# EasyEDA Pro project ProPrj_Micro-Profilometer_2025-09-25.epro, schematic Sch

## Sheets
1 Power: Board Name: 3DOF_DriveBoard; Create Date: 2025-06-26; Page Name: Power; Project Name: 3DOFPlatform; Schematic Name: 3DOF_DriveBoard; Update Date: 2025-07-22; Add into BOM: yes; Convert to PCB: yes
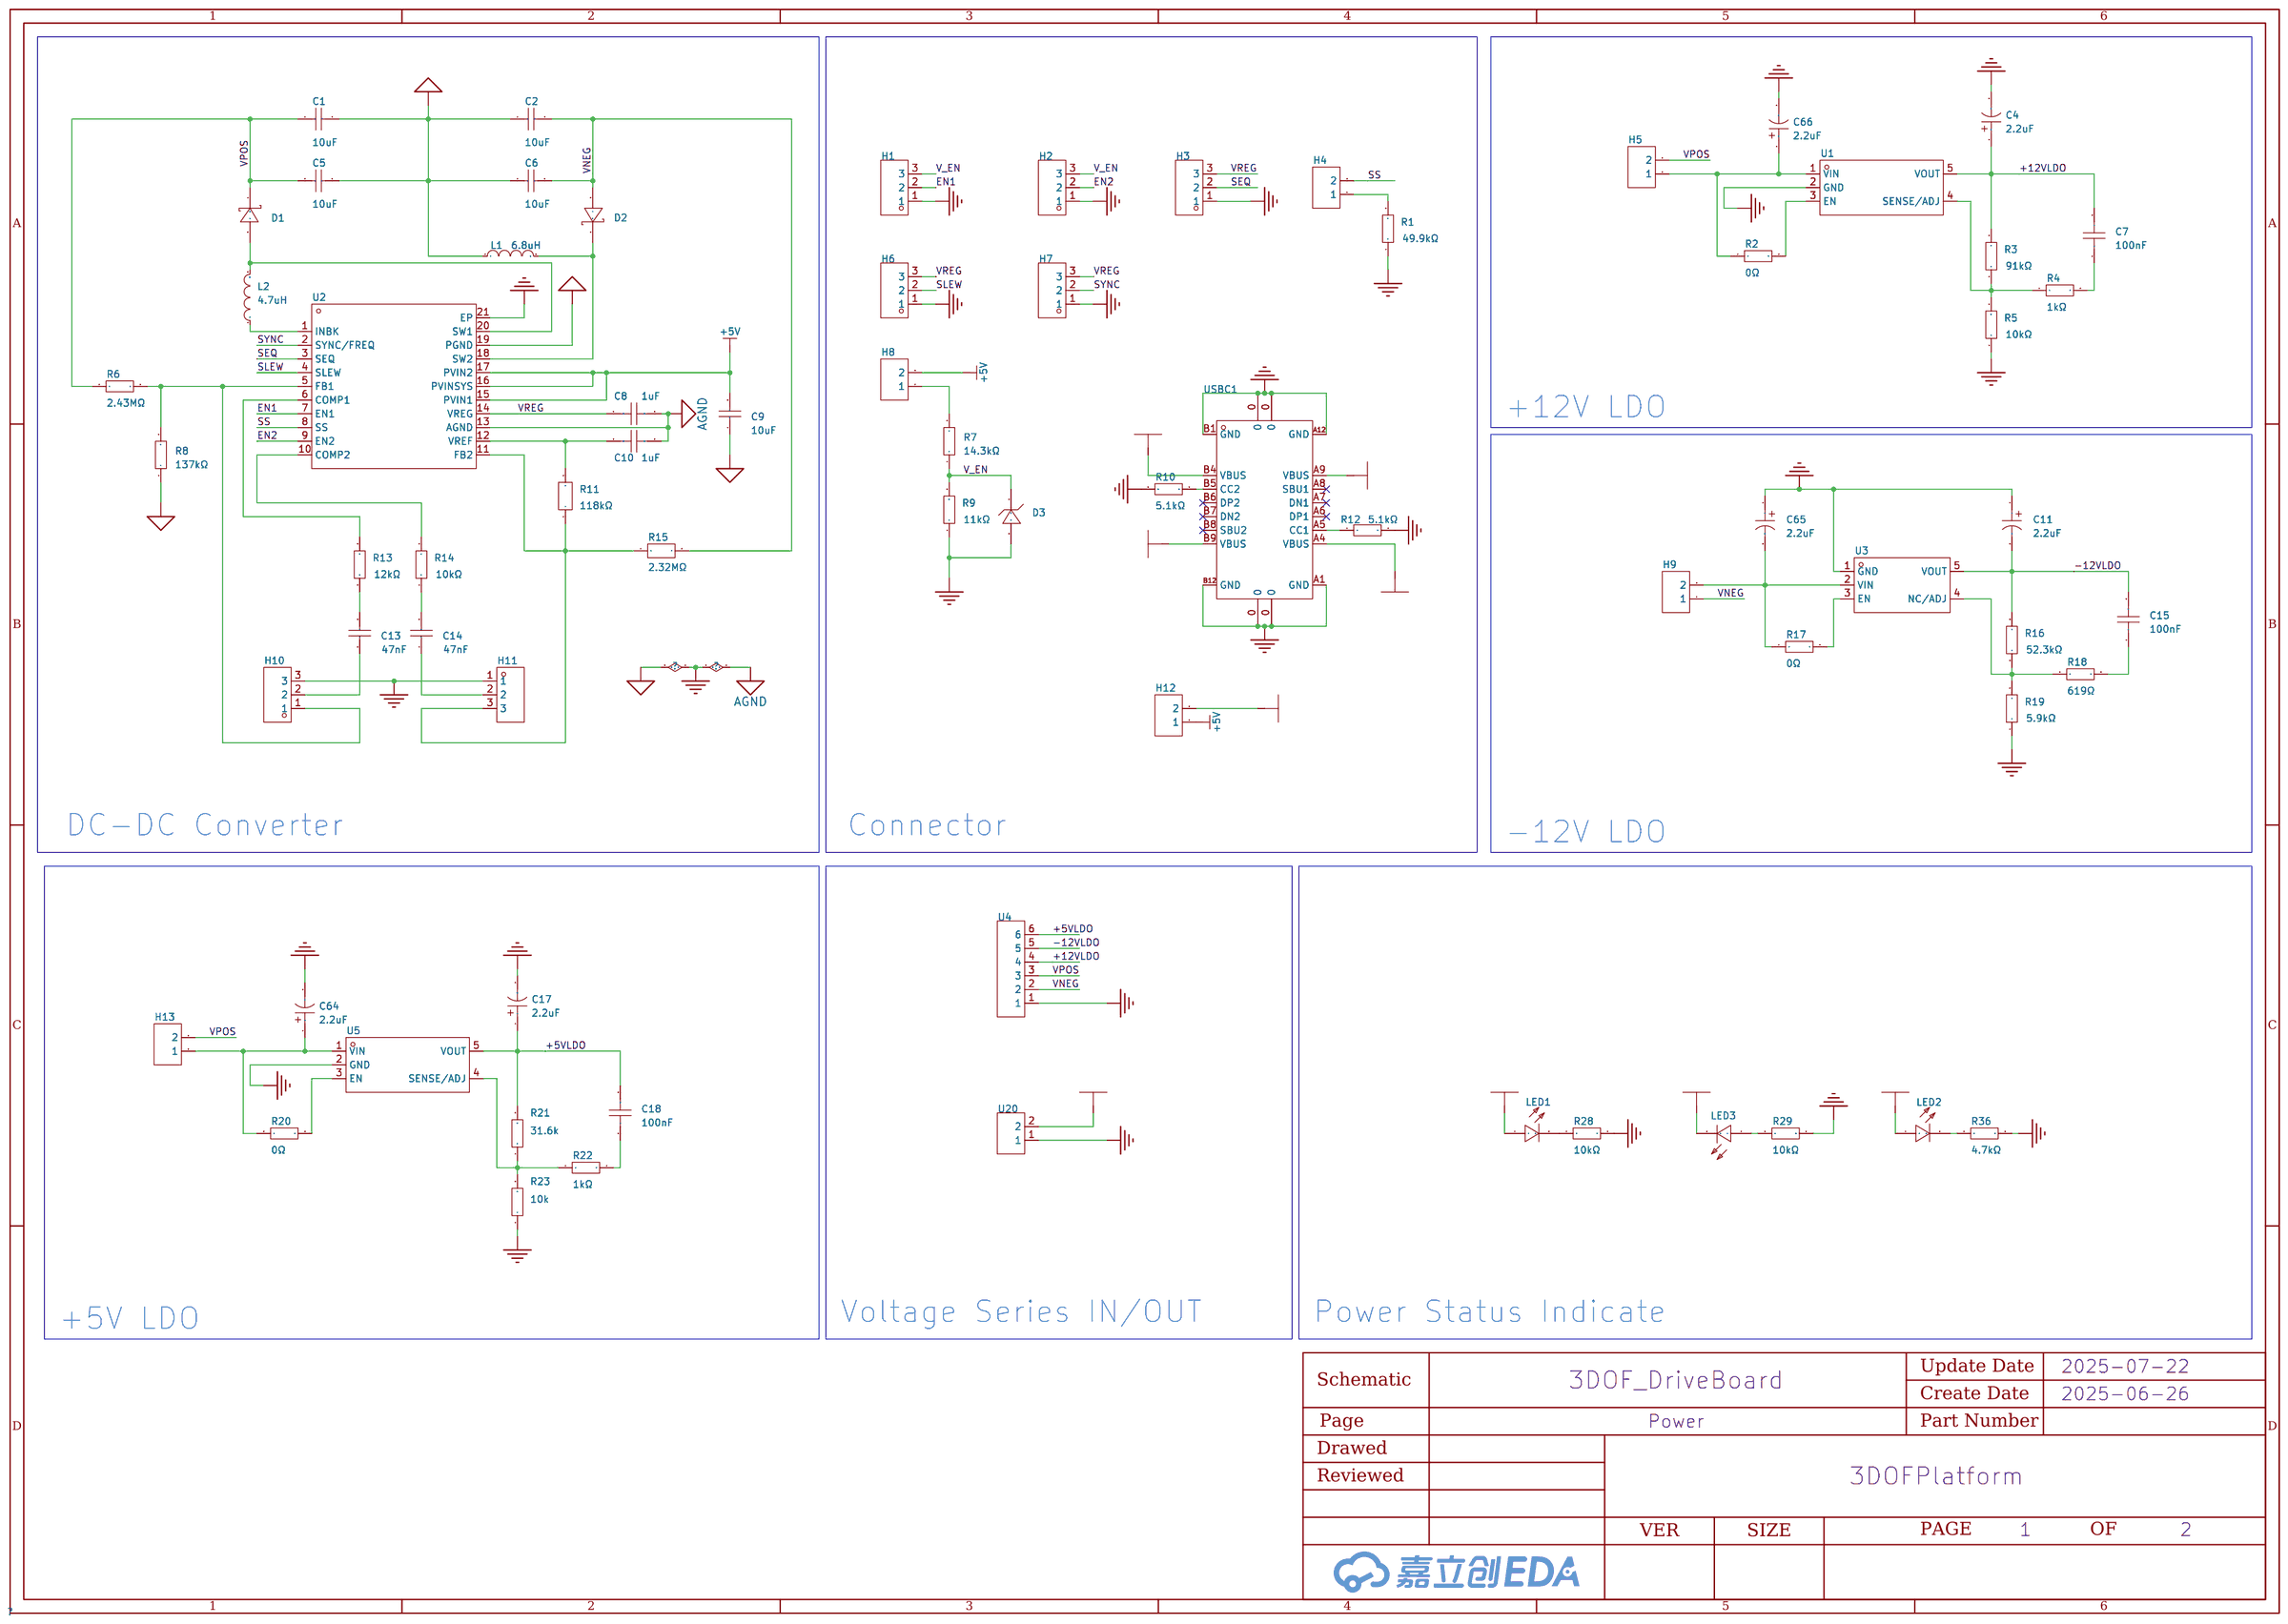
[diagram p0: Power]
2 Drivers: Board Name: MicroProfilometer; Create Date: 2025-09-18; Page Name: Drivers; Project Name: 微米级轮廓仪Micro-Profilometer; Schematic Name: Sch; Update Date: 2025-09-18; Company: 嘉立创EDA; Page Size: A3; Version: V1.0
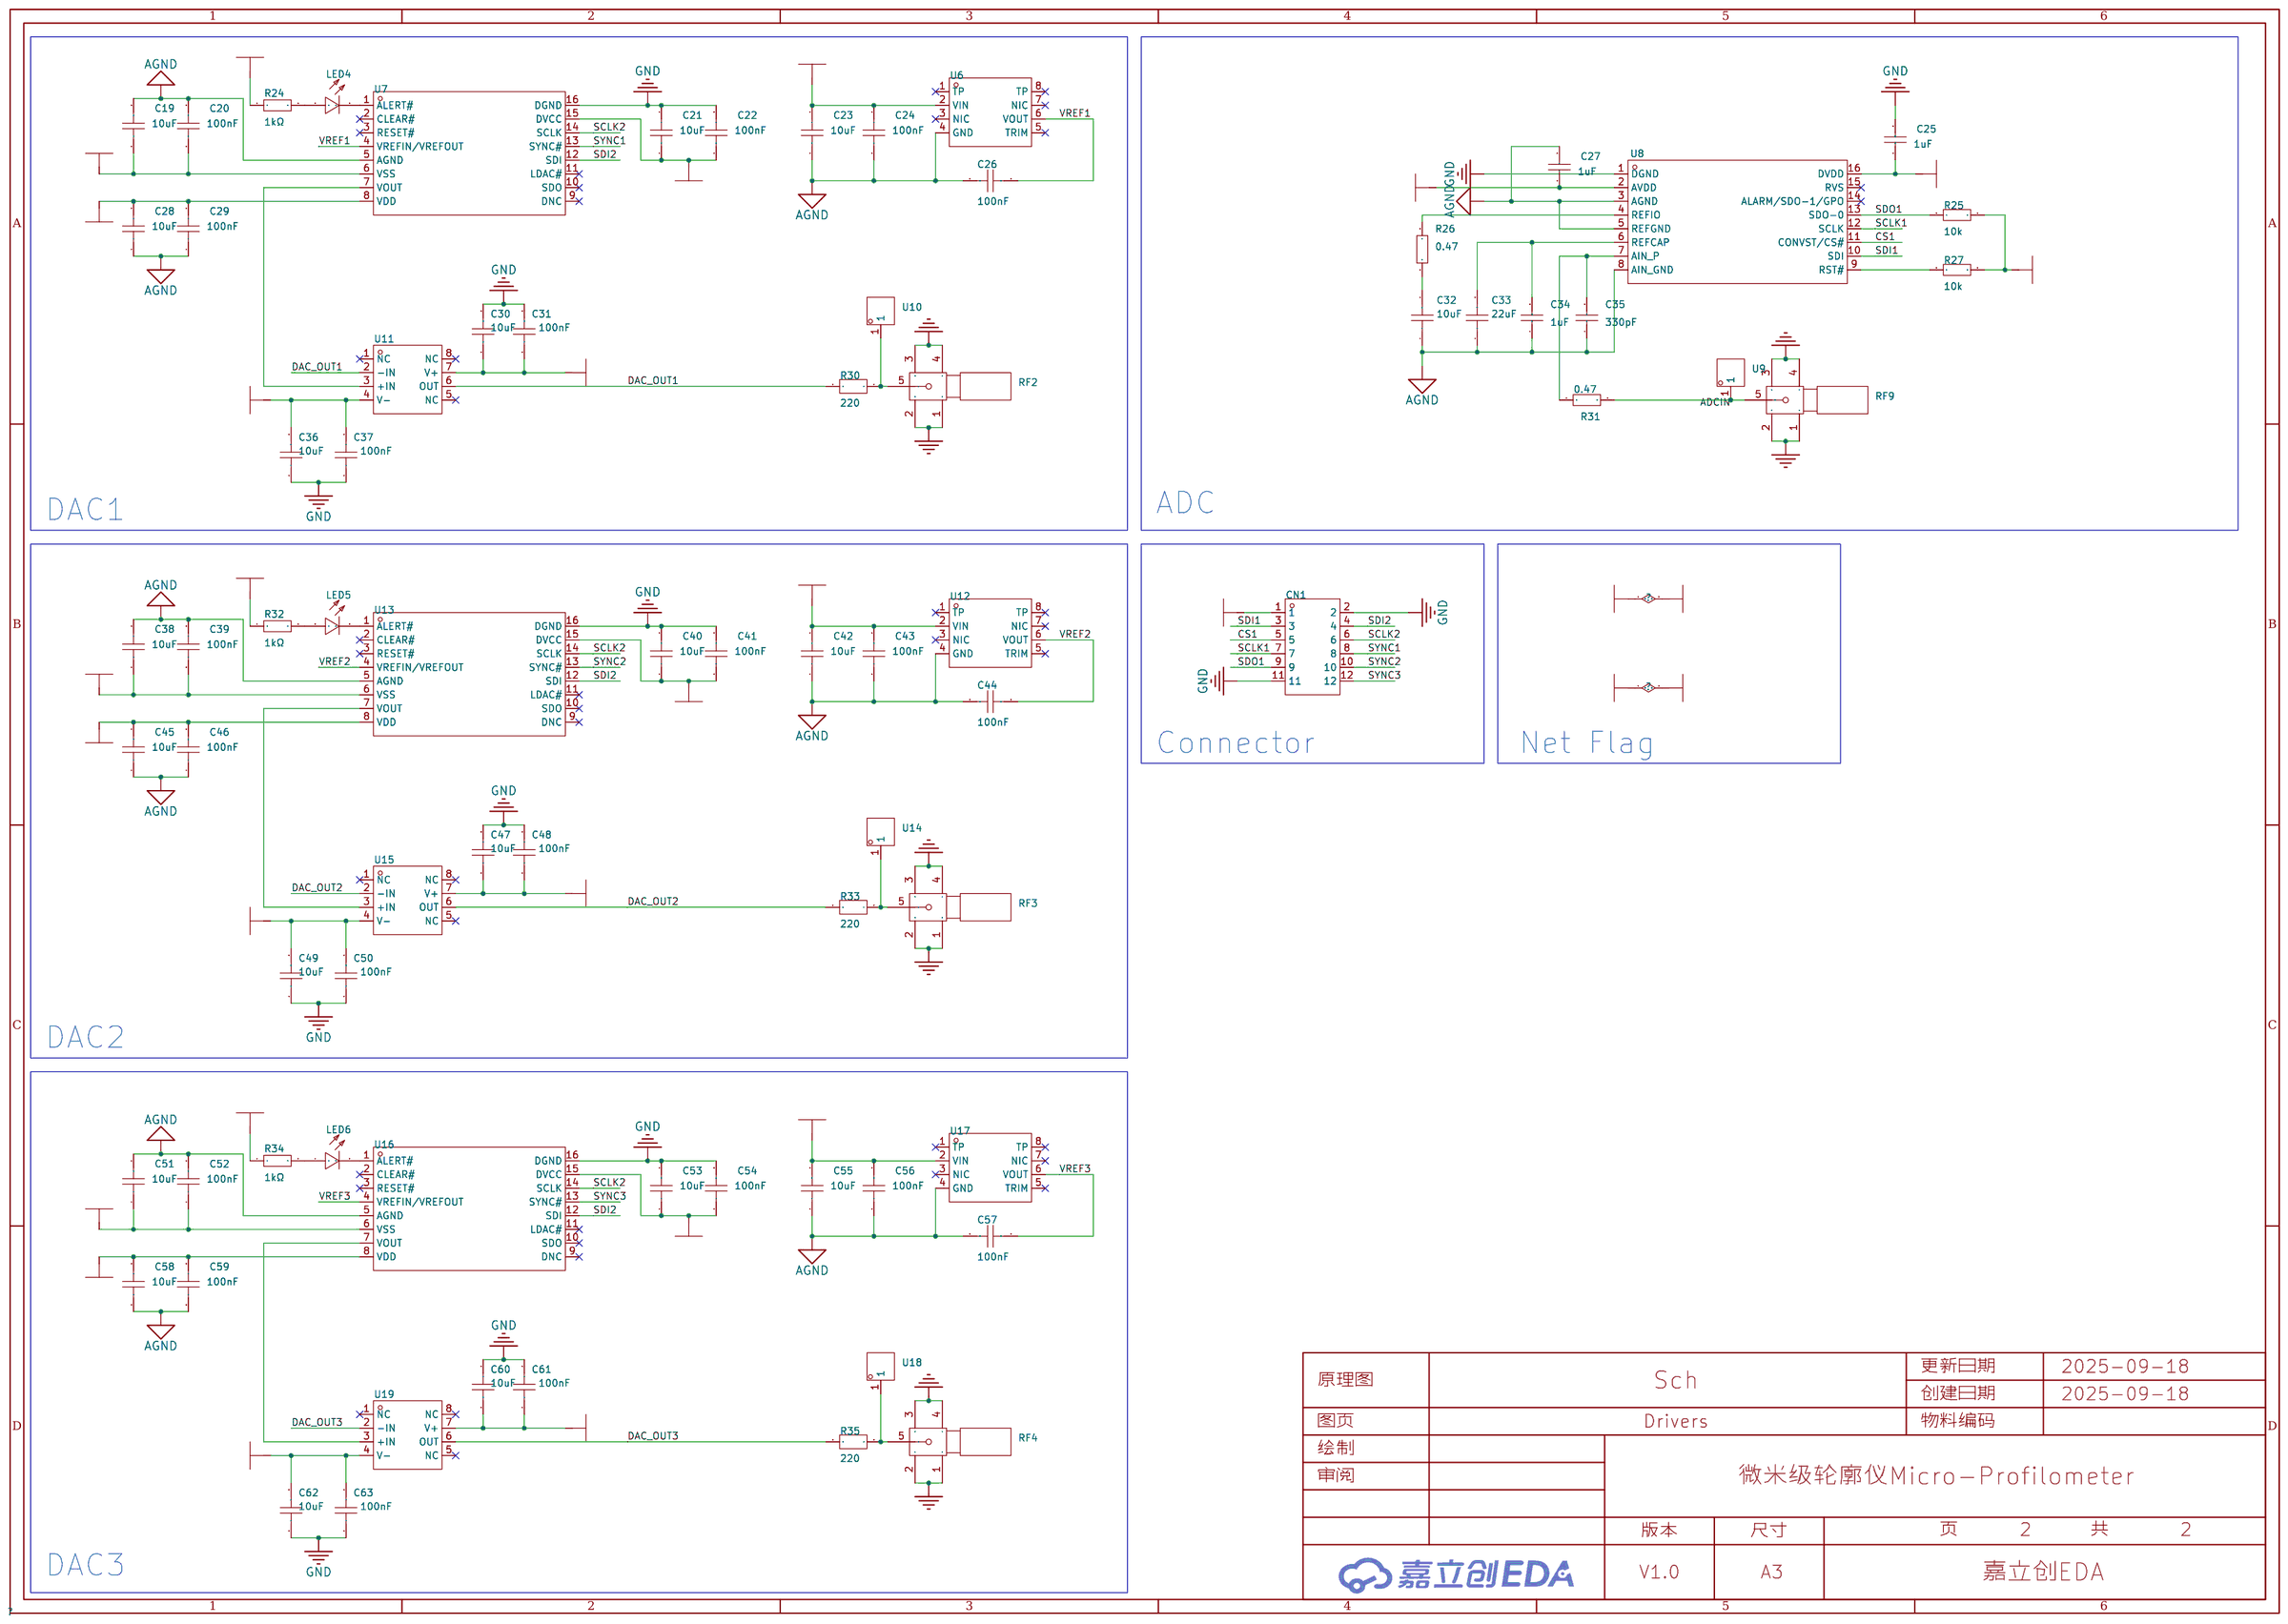
[diagram p1: Drivers]

## Parts
sheet Drivers
C19  10uF  [C0603]
C20  100nF  [C0603]
C21  10uF  [C0603]
C22  100nF  [C0603]
C23  10uF  [C0603]
C24  100nF  [C0603]
C25  1uF  [C0603]
C26  100nF  [C0603]
C27  1uF  [C0603]
C28  10uF  [C0603]
C29  100nF  [C0603]
C30  10uF  [C0603]
C31  100nF  [C0603]
C32  10uF  [C0603]
C33  22uF  [C0603]
C34  1uF  [C0603]
C35  330pF  [C0603]
C36  10uF  [C0603]
C37  100nF  [C0603]
C38  10uF  [C0603]
C39  100nF  [C0603]
C40  10uF  [C0603]
C41  100nF  [C0603]
C42  10uF  [C0603]
C43  100nF  [C0603]
C44  100nF  [C0603]
C45  10uF  [C0603]
C46  100nF  [C0603]
C47  10uF  [C0603]
C48  100nF  [C0603]
C49  10uF  [C0603]
C50  100nF  [C0603]
C51  10uF  [C0603]
C52  100nF  [C0603]
C53  10uF  [C0603]
C54  100nF  [C0603]
C55  10uF  [C0603]
C56  100nF  [C0603]
C57  100nF  [C0603]
C58  10uF  [C0603]
C59  100nF  [C0603]
C60  10uF  [C0603]
C61  100nF  [C0603]
C62  10uF  [C0603]
C63  100nF  [C0603]
CN1  X9555WR-2x06-6TV01  [IDC-TH_12P-P2.54_BOOMELE-2X6P]
LED4  -  [LED0603-R-RD]
LED5  -  [LED0603-R-RD]
LED6  -  [LED0603-R-RD]
R24  1kΩ  [R0603]
R25  10k  [R0603]
R26  0.47  [R0603]
R27  10k  [R0603]
R30  220  [R0603]
R31  0.47  [R0603]
R32  1kΩ  [R0603]
R33  220  [R0603]
R34  1kΩ  [R0603]
R35  220  [R0603]
RF2  -  [SMA-TH_BWSMA-KWE-Z001]
RF3  -  [SMA-TH_BWSMA-KWE-Z001]
RF4  -  [SMA-TH_BWSMA-KWE-Z001]
RF9  -  [SMA-TH_BWSMA-KWE-Z001]
U6  -  [SOIC-8_L4.9-W3.9-P1.27-LS6.0-BL]
U7  -  [TSSOP-16_L5.0-W4.4-P0.65-LS6.4-TL]
U8  -  [TSSOP-16_L5.0-W4.4-P0.65-LS6.4-TL]
U9  -  [TEST-SMD_L2.7-W1.0]
U10  -  [TEST-SMD_L2.7-W1.0]
U11  -  [SOIC-8_L4.9-W3.9-P1.27-LS6.0-BL]
U12  -  [SOIC-8_L4.9-W3.9-P1.27-LS6.0-BL]
U13  -  [TSSOP-16_L5.0-W4.4-P0.65-LS6.4-TL]
U14  -  [TEST-SMD_L2.7-W1.0]
U15  -  [SOIC-8_L4.9-W3.9-P1.27-LS6.0-BL]
U16  -  [TSSOP-16_L5.0-W4.4-P0.65-LS6.4-TL]
U17  -  [SOIC-8_L4.9-W3.9-P1.27-LS6.0-BL]
U18  -  [TEST-SMD_L2.7-W1.0]
U19  -  [SOIC-8_L4.9-W3.9-P1.27-LS6.0-BL]
sheet Power
C1  10uF  [C1206]
C2  10uF  [C1206]
C4  2.2uF  [CAP-SMD_L3.2-W1.6]
C5  10uF  [C1206]
C6  10uF  [C1206]
C7  100nF  [C0603]
C8  1uF  [C0603]
C9  10uF  [C1206]
C10  1uF  [C0603]
C11  2.2uF  [CAP-SMD_L3.2-W1.6]
C13  47nF  [C0603]
C14  47nF  [C0603]
C15  100nF  [C0603]
C17  2.2uF  [CAP-SMD_L3.2-W1.6]
C18  100nF  [C0603]
C64  2.2uF  [CAP-SMD_L3.2-W1.6]
C65  2.2uF  [CAP-SMD_L3.2-W1.6]
C66  2.2uF  [CAP-SMD_L3.2-W1.6]
D1  DFLS240-7  [POWERDI-123_L2.8-W1.8-LS3.7-RD]
D2  DFLS240-7  [POWERDI-123_L2.8-W1.8-LS3.7-RD]
D3  MMSZ5233B-7-F  [SOD-123_L2.7-W1.6-LS3.7-RD]
H1  -  [HDR-TH_3P-P2.54-V-F]
H2  -  [HDR-TH_3P-P2.54-V-F]
H3  -  [HDR-TH_3P-P2.54-V-F]
H4  -  [HDR-TH_2P-P2.54-V-F]
H5  -  [HDR-TH_2P-P2.54-V-F]
H6  -  [HDR-TH_3P-P2.54-V-F]
H7  -  [HDR-TH_3P-P2.54-V-F]
H8  -  [HDR-TH_2P-P2.54-V-F]
H9  -  [HDR-TH_2P-P2.54-V-F]
H10  -  [HDR-TH_3P-P2.54-V-F]
H11  -  [HDR-TH_3P-P2.54-V-F]
H12  -  [HDR-TH_2P-P2.54-V-F]
H13  -  [HDR-TH_2P-P2.54-V-F]
L1  6.8uH  [IND-SMD_L7.0-W6.6]
L2  4.7uH  [IND-SMD_L5.4-W5.2]
LED1  -  [LED0603-R-RD]
LED2  -  [LED0603-R-RD]
LED3  -  [LED0603-R-RD]
R1  49.9kΩ  [R0603]
R2  0Ω  [R0603]
R3  91kΩ  [R0603]
R4  1kΩ  [R0603]
R5  10kΩ  [R0603]
R6  2.43MΩ  [R0603]
R7  14.3kΩ  [R0603]
R8  137kΩ  [R0603]
R9  11kΩ  [R0603]
R10  5.1kΩ  [R0603]
R11  118kΩ  [R0603]
R12  5.1kΩ  [R0603]
R13  12kΩ  [R0603]
R14  10kΩ  [R0603]
R15  2.32MΩ  [R0603]
R16  52.3kΩ  [R0603]
R17  0Ω  [R0603]
R18  619Ω  [R0603]
R19  5.9kΩ  [R0603]
R20  0Ω  [R0603]
R21  31.6k  [R0603]
R22  1kΩ  [R0603]
R23  10k  [R0603]
R28  10kΩ  [R0603]
R29  10kΩ  [R0603]
R36  4.7kΩ  [R0603]
U1  ADP7118AUJZ-R7  [TSOT-23-5_L2.9-W1.6-P0.95-LS2.8-BR]
U2  ADP5070ACPZ-R7  [LFCSP-20_L4.0-W4.0-P0.50-TL-EP2.6]
U3  ADP7182AUJZ-R7  [TSOT-23-5_L2.9-W1.6-P0.95-LS2.8-BR]
U4  MX128-2.54-06P-GN01-Cu-Y-A  [CONN-TH_6P-P2.54_MX128-2.54-6P]
U5  ADP7118AUJZ-R7  [TSOT-23-5_L2.9-W1.6-P0.95-LS2.8-BR]
U20  DB125-2.54-2P-GN-S  [CONN-TH_DB125-2.54-2P-GN]
USBC1  -  [USB-C_SMD-TYPE-C-31-M-12]

## Library data of the parts
C19 C21 C23 C28 C30 C32 C36 C38 C40 C42 C45 C47 C49 C51 C53 C55 C58 C60 C62 = GRM188R61E106MA73D: 容值:10uF;精度:±20%;额定电压:25V;温度系数:X5R;; LCSC Part Name: 10uF ±20% 25V; Supplier Part: C91606; Manufacturer: muRata(村田); Supplier Footprint: 0603; JLCPCB Part Class: Extended Part; Datasheet: https://atta.szlcsc.com/upload/public/pdf/source/20161226/1482720176185.pdf; Supplier: LCSC; Tolerance: ±20%; Voltage Rated: 25V; Temperature Coefficient: X5R
C20 C22 C24 C26 C29 C31 C37 C39 C41 C43 C44 C46 C48 C50 C52 C54 C56 C57 C59 C61 C63 = CL10B104KA8NNNC: 容值:100nF;精度:±10%;额定电压:25V;温度系数:X7R;; LCSC Part Name: 100nF ±10% 25V; Supplier Part: C1590; Manufacturer: SAMSUNG(三星); Supplier Footprint: 0603; JLCPCB Part Class: Extended Part; Datasheet: https://atta.szlcsc.com/upload/public/pdf/source/20160103/1457707680294.pdf; Supplier: LCSC; Tolerance: ±10%; Voltage Rated: 25V; Temperature Coefficient: X7R
C25 C27 C34 = CL10A105KA8NNNC: 容值:1uF;精度:±10%;额定电压:25V;温度系数:X5R;; LCSC Part Name: 1uF ±10% 25V; Supplier Part: C5673; Manufacturer: SAMSUNG(三星); Supplier Footprint: 0603; JLCPCB Part Class: Extended Part; Datasheet: https://atta.szlcsc.com/upload/public/pdf/source/20160103/1457707739994.pdf; Supplier: LCSC; Tolerance: ±10%; Voltage Rated: 25V; Temperature Coefficient: X5R
C33 = CL10A226MP8NUNE: 容值:22uF;精度:±20%;额定电压:10V;温度系数:X5R;; LCSC Part Name: 22uF ±20% 10V; Supplier Part: C86295; Manufacturer: SAMSUNG(三星); Supplier Footprint: 0603; JLCPCB Part Class: Extended Part; Datasheet: https://atta.szlcsc.com/upload/public/pdf/source/20170325/1490427882169.pdf; Supplier: LCSC; Tolerance: ±20%; Voltage Rated: 10V; Temperature Coefficient: X5R
C35 = CL10C331JB8NNNC: 容值:330pF;精度:±5%;额定电压:50V;温度系数:C0G;; LCSC Part Name: 330pF ±5% 50V; Supplier Part: C1664; Manufacturer: SAMSUNG(三星); Supplier Footprint: 0603; JLCPCB Part Class: Basic Part; Datasheet: https://atta.szlcsc.com/upload/public/pdf/source/20160103/1457707688612.pdf; Supplier: LCSC; Tolerance: ±5%; Voltage Rated: 50V; Temperature Coefficient: C0G
CN1 = X9555WR-2x06-6TV01: 插针结构:2x6P;间距:2.54mm;安装方式:弯插;参考系列:-;总PIN数:12P;排数:2;每排PIN数:6;行距:2.54mm;额定电流:3A;触头材质:黄铜;触头镀层:锡;工作温度范围:-;; LCSC Part Name: 2x6P 间距:2.54mm 弯插; Supplier Part: C2682218; Manufacturer: XKB Connection(中国星坤); Supplier Footprint: 弯插,P=2.54mm; JLCPCB Part Class: 扩展库; Datasheet: https://atta.szlcsc.com/upload/public/pdf/source/20211009/ED69AC5D0B165AFEE3838F4DF324EF6E.pdf; Supplier: LCSC; Pins Structure: 2x6P; Pitch: 2.54mm; Mounting Style: 弯插; Number of Pins: 12P; Number of Rows: 2; Number of PINs Per Row: 6; Row Spacing: 2.54mm; Current Rating (Max): 3A; Contact Material: 黄铜; Contact Plating: 锡
LED1-LED6 = 19-217/R6C-AL1M2VY/3T: 发光颜色:红灯;二极管配置:-;透镜颜色:无色透明;主波长:617.5nm;峰值波长:632nm;色温:-;光通量(25时):-;测试电流:5mA;正向电压(VF):2.2V;发光强度:28.5mcd;功率:60mW;发光角度:120°;安装方式:-;工作温度:-40~+85;; LCSC Part Name: 0603 红灯; Supplier Part: C72044; Manufacturer: EVERLIGHT(台湾亿光); Supplier Footprint: 0603; JLCPCB Part Class: Extended Part; Datasheet: https://atta.szlcsc.com/upload/public/pdf/source/20160507/1462613613821.pdf; Supplier: LCSC; Emitted Color: 红灯; Lens Color: 无色透明; Dominant Wavelength: 617.5nm; Peak Wavelength: 632nm; Forward Current: 5mA; Forward Voltage (VF): 2.2V; Luminous Intensity: 28.5mcd; Power Dissipation: 60mW; Viewing Angle: 120°; Operating Temperature: -40~+85
R4 R22 R24 R32 R34 = 0603WAF1001T5E: 电阻类型:厚膜电阻;阻值:1kΩ;精度:±1%;功率:100mW;温度系数:±100ppm/℃;最大工作电压:75V;工作温度范围:-55℃~+155℃;; LCSC Part Name: 1kΩ±1%100mW; Supplier Part: C21190; Manufacturer: UNI-ROYAL(厚声); Supplier Footprint: 0603; JLCPCB Part Class: BasicPart; Datasheet: https://atta.szlcsc.com/upload/public/pdf/source/20200306/C422600_1E6D84923E4A46A82E41ADD87F860B5C.pdf; Supplier: LCSC; Type: 厚膜电阻; Tolerance: ±1%; Power(Watts): 100mW; Temperature Coefficient: ±100ppm/℃; Overload Voltage (Max): 75V; Operating Temperature Range: -55℃~+155℃
R25 R27 = 0603WAF1002T5E: 电阻类型:厚膜电阻;阻值:10k;精度:±1%;功率:1/10W;温度系数:±100ppm/;最大工作电压:75V;工作温度范围:-55~+155;; LCSC Part Name: 10k ±1%; Supplier Part: C25804; Manufacturer: UNI-ROYAL(厚声); Supplier Footprint: 0603; JLCPCB Part Class: Basic Part; Datasheet: https://atta.szlcsc.com/upload/public/pdf/source/20200306/C422600_1E6D84923E4A46A82E41ADD87F860B5C.pdf; Supplier: LCSC; Type: 厚膜电阻; Tolerance: ±1%; Power(Watts): 1/10W; Temperature Coefficient: ±100ppm/; Overload Voltage (Max): 75V; Operating Temperature Range: -55~+155
R26 R31 = RL0603FR-070R47L: 阻值:0.47;精度:±1%;功率:100mW;温度系数:±800ppm/;; LCSC Part Name: 0.47 ±1% 100mW; Supplier Part: C326953; Manufacturer: YAGEO(国巨); Supplier Footprint: 0603; JLCPCB Part Class: Extended Part; Datasheet: https://atta.szlcsc.com/upload/public/pdf/source/20181031/C326953_2A06D5EACD581F8EE6DB7FFE6C5B8872.pdf; Supplier: LCSC; Tolerance: ±1%; Power(Watts): 100mW; Temperature Coefficient: ±800ppm/
R30 R33 R35 = ERJU3RD2200V: 阻值:220;精度:±0.5%;功率:100mW;温度系数:±50ppm/;最大工作电压:-;工作温度范围:-55~+155;; LCSC Part Name: 220 ±0.5% 100mW; Supplier Part: C491169; Manufacturer: PANASONIC(松下); Supplier Footprint: 0603; JLCPCB Part Class: Extended Part; Datasheet: https://atta.szlcsc.com/upload/public/pdf/source/20200407/C491169_AC2E94AF70820CF85EC0143B46F9F0DA.pdf; Supplier: LCSC; Tolerance: ±0.5%; Power(Watts): 100mW; Temperature Coefficient: ±50ppm/; Operating Temperature Range: -55~+155
RF2-RF4 RF9 = BWSMA-KWE-Z001: 连接器类型:板端;射频系列:SMA;接口类型:内孔;端口数量:1;阻抗:-;频率-最大值:-;样式:弯头;接口直径:5.3mm;接口长度/高度:-;工作温度范围:-;; LCSC Part Name: SMA内孔弯头SMA天线座SMA弯头正脚板端座子; Supplier Part: C496551; Manufacturer: BATWIRELESS(蝙蝠无线); Supplier Footprint: 插件; JLCPCB Part Class: ExtendedPart; Datasheet: https://atta.szlcsc.com/upload/public/pdf/source/20201015/C496551_6AE7B02D24D60B4F78A8937E4C4F8093.pdf; Supplier: LCSC; Connector Type: 板端; RF Series: SMA; Interface Type: 内孔; Number of Ports: 1; Style: 弯头; Interface Diameter: 5.3mm
U6 U12 U17 = ADR421BRZ-REEL: Supplier Part: C496503; Manufacturer: ADI(亚德诺)/LINEAR; Supplier Footprint: SOIC-8; JLCPCB Part Class: Extended Part; Datasheet: https://atta.szlcsc.com/upload/public/pdf/source/20200316/C496503_A1F080746FA87D9455D96FF2B5AA62EC.pdf; Supplier: LCSC
U7 U13 U16 = AD5761RBRUZ: D/A 位数:-;D/A通道数:-;输出类型:-;读写接口类型:-;; Supplier Part: C404015; Manufacturer: ADI(亚德诺)/LINEAR; Supplier Footprint: TSSOP-16; JLCPCB Part Class: Extended Part; Datasheet: https://atta.szlcsc.com/upload/public/pdf/source/20190722/C404015_21C88E48C88813C7B0010A18F7ED8816.pdf; Supplier: LCSC
U8 = ADS8685IPWR: A/D 位数:-;采样率（sps）:-;输入数:-;输入类型:-;; Supplier Part: C2669941; Manufacturer: TI(德州仪器); Supplier Footprint: TSSOP-16; JLCPCB Part Class: Extended Part; Supplier: LCSC
U9 U10 U14 U18 = 5017: 连接器类型:测试点/测试环;颜色:-;; LCSC Part Name: 测试点/测试环; Supplier Part: C238130; Manufacturer: Keystone; JLCPCB Part Class: ExtendedPart; Datasheet: https://atta.szlcsc.com/upload/public/pdf/source/20180629/C238130_5A26801579F58754781F264880A43AC8.PDF; Supplier: LCSC; Connector Type: 测试点/测试环
U11 U15 U19 = AD8671ARZ-REEL7: 运放类型:General Purpose;放大器组数:1;增益带宽积（GBP）:10MHz;压摆率（SR）:4 V/us;电源电压:10V ~ 36V, ±5V ~ 18V;各通道供电电流:3mA;; Supplier Part: C56309; Manufacturer: ADI(亚德诺)/LINEAR; Supplier Footprint: SOIC-8_150mil; JLCPCB Part Class: ExtendedPart; Datasheet: https://atta.szlcsc.com/upload/public/pdf/source/20150821/1457707348731.pdf; Supplier: LCSC; Amplifier Type: GeneralPurpose; Number of Circuits: 1; Gain Bandwidth Product（GBP）: 10MHz; Slew Rate（SR）: 4V/us; Supply Voltage（Single）: 10V~36V,±5V~18V; Iq per channel (Typ): 3mA; Operating Temperature: -40°C~125°C
C1 C2 C5 C6 C9 = CL31A106KBHNNNE: 容值:10uF;精度:±10%;额定电压:50V;材质(温度系数):X5R;; LCSC Part Name: 10uF±10%50V; Supplier Part: C13585; Manufacturer: SAMSUNG(三星); Supplier Footprint: 1206; JLCPCB Part Class: BasicPart; Datasheet: https://atta.szlcsc.com/upload/public/pdf/source/20160103/1457707668742.pdf; Supplier: LCSC; Tolerance: ±10%; Voltage Rated: 50V; Temperature Coefficient: X5R
C4 C11 C17 C64-C66 = T491A225M016AT: 容值:2.2uF;精度:±20%;额定电压:16V;漏电流:-;纹波电流:-;等效串联电阻:6Ω;工作温度:-55℃~+125℃;; LCSC Part Name: 2.2uF±20%16V; Supplier Part: C1953932; Manufacturer: KEMET(基美); Supplier Footprint: 1206; JLCPCB Part Class: ExtendedPart; Datasheet: https://atta.szlcsc.com/upload/public/pdf/source/20210416/95C0EC5B3581C9A90529545117ABEAC1.pdf; Supplier: LCSC; Tolerance: ±20%; Rated Voltage: 16V; Equivalent Series Resistance(ESR): 6Ω; Operating Temperature: -55℃~+125℃
C7 C15 C18 = CC0603KRX7R9BB104: 容值:100nF;精度:±10%;额定电压:50V;材质(温度系数):X7R;; LCSC Part Name: 100nF±10%50V; Supplier Part: C14663; Manufacturer: YAGEO(国巨); Supplier Footprint: 0603; JLCPCB Part Class: BasicPart; Datasheet: https://atta.szlcsc.com/upload/public/pdf/source/20180910/C282072_33301C7F631E79921B82A8DAC6BCC5B3.pdf; Supplier: LCSC; Tolerance: ±10%; Voltage Rated: 50V; Temperature Coefficient: X7R
C8 C10 = CL10A105KL8NNNC: 容值:1uF;精度:±10%;额定电压:35V;材质(温度系数):-;; LCSC Part Name: 1uF±10%35V; Supplier Part: C478859; Manufacturer: SAMSUNG(三星); Supplier Footprint: 0603; JLCPCB Part Class: ExtendedPart; Datasheet: https://atta.szlcsc.com/upload/public/pdf/source/20200102/C478859_0EBF0387113597ECF4C91C52A34CAFD4.pdf; Supplier: LCSC; Tolerance: ±10%; Voltage Rated: 35V
C13 C14 = CL10B473KB8NNNC: 容值:47nF;精度:±10%;额定电压:50V;材质(温度系数):X7R;; LCSC Part Name: 47nF±10%50V; Supplier Part: C1622; Manufacturer: SAMSUNG(三星); Supplier Footprint: 0603; JLCPCB Part Class: BasicPart; Datasheet: https://atta.szlcsc.com/upload/public/pdf/source/20160103/1457707684971.pdf; Supplier: LCSC; Tolerance: ±10%; Voltage Rated: 50V; Temperature Coefficient: X7R
D1 D2 = DFLS240-7: 直流反向耐压(Vr):40V;平均整流电流(Io):2A;正向压降(Vf):700mV@2A;; LCSC Part Name: 40V2A700mV@2A; Supplier Part: C124195; Manufacturer: DIODES(美台); Supplier Footprint: PowerDI-123; JLCPCB Part Class: ExtendedPart; Datasheet: https://atta.szlcsc.com/upload/public/pdf/source/20170804/C124195_1501836226603866204.pdf; Supplier: LCSC; Reverse Voltage (Vr): 40V; Average Rectified Current (Io): 2A; Forward Voltage (Vf@If): 700mV@2A
D3 = MMSZ5233B-7-F: 二极管配置:独立式;稳压值(标称值):6V;稳压值(范围):5.7V~6.3V;精度:-;功率:500mW;反向电流(Ir):5uA@3.5V;阻抗(Zzt):7Ω;; LCSC Part Name: 6V500mW; Supplier Part: C151381; Manufacturer: DIODES(美台); Supplier Footprint: SOD-123; JLCPCB Part Class: ExtendedPart; Datasheet: https://atta.szlcsc.com/upload/public/pdf/source/20171225/C151381_15141883629451203191.pdf; Supplier: LCSC; Diode Configuration: 独立式; Zener Voltage (Nom): 6V; Zener Voltage (Range): 5.7V~6.3V; Power Dissipation: 500mW; Reverse Leakage Current (Ir): 5uA@3.5V; Zener Impedance (Zzt): 7Ω
H1-H3 H6 H7 H10 H11 = HDR-F_2.54_1x3P: Supplier Part: C541850; Supplier Footprint: 插件
H4 H5 H8 H9 H12 H13 = HDR-F_2.54_1x2P: Supplier Part: C49661; Supplier Footprint: 插件
L1 = MWSA0603S-6R8MT: 电感值:6.8uH;精度:±20%;额定电流:5A;直流电阻(DCR):48mΩ;; LCSC Part Name: 6.8uH±20%5A48mΩ; Supplier Part: C408449; Manufacturer: Sunlord(顺络); Supplier Footprint: SMD; JLCPCB Part Class: ExtendedPart; Datasheet: https://atta.szlcsc.com/upload/public/pdf/source/20190729/C408449_00E8ADA0E11DB85AE9F292F565DACFA0.pdf; Supplier: LCSC; Tolerance: ±20%; Rated Current: 5A; DC Resistance (DCR): 48mΩ
L2 = MWSA0503S-4R7MT: 电感值:4.7uH;精度:±20%;额定电流:4.5A;直流电阻(DCR):60mΩ;; LCSC Part Name: 4.7uH±20%4.5A60mΩ; Supplier Part: C408410; Manufacturer: Sunlord(顺络); Supplier Footprint: SMD; JLCPCB Part Class: ExtendedPart; Datasheet: https://atta.szlcsc.com/upload/public/pdf/source/20190729/C408410_8AE9F4BE330F0D24FED3825A68E3306A.pdf; Supplier: LCSC; Tolerance: ±20%; Rated Current: 4.5A; DC Resistance (DCR): 60mΩ
R1 = 0603WAF4992T5E: 电阻类型:厚膜电阻;阻值:49.9kΩ;精度:±1%;功率:100mW;温度系数:±100ppm/℃;最大工作电压:75V;工作温度范围:-55℃~+155℃;; LCSC Part Name: 49.9kΩ±1%100mW; Supplier Part: C23184; Manufacturer: UNI-ROYAL(厚声); Supplier Footprint: 0603; JLCPCB Part Class: BasicPart; Datasheet: https://atta.szlcsc.com/upload/public/pdf/source/20200306/C422600_1E6D84923E4A46A82E41ADD87F860B5C.pdf; Supplier: LCSC; Type: 厚膜电阻; Tolerance: ±1%; Power(Watts): 100mW; Temperature Coefficient: ±100ppm/℃; Overload Voltage (Max): 75V; Operating Temperature Range: -55℃~+155℃
R2 R17 R20 = 0603WAF0000T5E: 电阻类型:厚膜电阻;阻值:0Ω;精度:±1%;功率:100mW;最大工作电压:75V;工作温度范围:-55℃~+155℃;; LCSC Part Name: 0Ω±1%100mW; Supplier Part: C21189; Manufacturer: UNI-ROYAL(厚声); Supplier Footprint: 0603; JLCPCB Part Class: BasicPart; Datasheet: https://atta.szlcsc.com/upload/public/pdf/source/20200306/C422600_1E6D84923E4A46A82E41ADD87F860B5C.pdf; Supplier: LCSC; Type: 厚膜电阻; Tolerance: ±1%; Power(Watts): 100mW; Overload Voltage (Max): 75V; Operating Temperature Range: -55℃~+155℃
R3 = 0603WAF9102T5E: 电阻类型:厚膜电阻;阻值:91kΩ;精度:±1%;功率:100mW;温度系数:±100ppm/℃;最大工作电压:75V;工作温度范围:-55℃~+155℃;; LCSC Part Name: 91kΩ±1%100mW; Supplier Part: C23265; Manufacturer: UNI-ROYAL(厚声); Supplier Footprint: 0603; JLCPCB Part Class: BasicPart; Datasheet: https://atta.szlcsc.com/upload/public/pdf/source/20200306/C422600_1E6D84923E4A46A82E41ADD87F860B5C.pdf; Supplier: LCSC; Type: 厚膜电阻; Tolerance: ±1%; Power(Watts): 100mW; Temperature Coefficient: ±100ppm/℃; Overload Voltage (Max): 75V; Operating Temperature Range: -55℃~+155℃
R5 R14 R28 R29 = 0603WAF1002T5E: 电阻类型:厚膜电阻;阻值:10kΩ;精度:±1%;功率:100mW;温度系数:±100ppm/℃;最大工作电压:75V;工作温度范围:-55℃~+155℃;; LCSC Part Name: 10kΩ±1%100mW; Supplier Part: C25804; Manufacturer: UNI-ROYAL(厚声); Supplier Footprint: 0603; JLCPCB Part Class: BasicPart; Datasheet: https://atta.szlcsc.com/upload/public/pdf/source/20200306/C422600_1E6D84923E4A46A82E41ADD87F860B5C.pdf; Supplier: LCSC; Type: 厚膜电阻; Tolerance: ±1%; Power(Watts): 100mW; Temperature Coefficient: ±100ppm/℃; Overload Voltage (Max): 75V; Operating Temperature Range: -55℃~+155℃
R6 = RS-03L2434FT: 阻值:2.43MΩ;精度:±1%;功率:100mW;温度系数:±250ppm/℃;最大工作电压:50V;工作温度范围:-55℃~+155℃;; LCSC Part Name: 2.43MΩ±1%100mW; Supplier Part: C322108; Manufacturer: FH(风华); Supplier Footprint: 0603; JLCPCB Part Class: ExtendedPart; Datasheet: https://atta.szlcsc.com/upload/public/pdf/source/20181211/C322108_00DFEDFB5C93DEA336AB14E1914F72A4.pdf; Supplier: LCSC; Tolerance: ±1%; Power(Watts): 100mW; Temperature Coefficient: ±250ppm/℃; Overload Voltage (Max): 50V; Operating Temperature Range: -55℃~+155℃
R7 = 0603WAF1432T5E: 电阻类型:厚膜电阻;阻值:14.3kΩ;精度:±1%;功率:100mW;温度系数:±100ppm/℃;最大工作电压:75V;工作温度范围:-55℃~+155℃;; LCSC Part Name: 14.3kΩ±1%100mW; Supplier Part: C22799; Manufacturer: UNI-ROYAL(厚声); Supplier Footprint: 0603; JLCPCB Part Class: ExtendedPart; Datasheet: https://atta.szlcsc.com/upload/public/pdf/source/20200306/C422600_1E6D84923E4A46A82E41ADD87F860B5C.pdf; Supplier: LCSC; Type: 厚膜电阻; Tolerance: ±1%; Power(Watts): 100mW; Temperature Coefficient: ±100ppm/℃; Overload Voltage (Max): 75V; Operating Temperature Range: -55℃~+155℃
R8 = 0603WAF1373T5E: 电阻类型:厚膜电阻;阻值:137kΩ;精度:±1%;功率:100mW;温度系数:±100ppm/℃;最大工作电压:75V;工作温度范围:-55℃~+155℃;; LCSC Part Name: 137kΩ±1%100mW; Supplier Part: C22872; Manufacturer: UNI-ROYAL(厚声); Supplier Footprint: 0603; JLCPCB Part Class: ExtendedPart; Datasheet: https://atta.szlcsc.com/upload/public/pdf/source/20200306/C422600_1E6D84923E4A46A82E41ADD87F860B5C.pdf; Supplier: LCSC; Type: 厚膜电阻; Tolerance: ±1%; Power(Watts): 100mW; Temperature Coefficient: ±100ppm/℃; Overload Voltage (Max): 75V; Operating Temperature Range: -55℃~+155℃
R9 = 0603WAF1102T5E: 电阻类型:厚膜电阻;阻值:11kΩ;精度:±1%;功率:100mW;温度系数:±100ppm/℃;最大工作电压:75V;工作温度范围:-55℃~+155℃;; LCSC Part Name: 11kΩ±1%100mW; Supplier Part: C25950; Manufacturer: UNI-ROYAL(厚声); Supplier Footprint: 0603; JLCPCB Part Class: BasicPart; Datasheet: https://atta.szlcsc.com/upload/public/pdf/source/20200306/C422600_1E6D84923E4A46A82E41ADD87F860B5C.pdf; Supplier: LCSC; Type: 厚膜电阻; Tolerance: ±1%; Power(Watts): 100mW; Temperature Coefficient: ±100ppm/℃; Overload Voltage (Max): 75V; Operating Temperature Range: -55℃~+155℃
R10 R12 = 0603WAF5101T5E: 电阻类型:厚膜电阻;阻值:5.1kΩ;精度:±1%;功率:100mW;温度系数:±100ppm/℃;最大工作电压:75V;工作温度范围:-55℃~+155℃;; LCSC Part Name: 5.1kΩ±1%100mW; Supplier Part: C23186; Manufacturer: UNI-ROYAL(厚声); Supplier Footprint: 0603; JLCPCB Part Class: BasicPart; Datasheet: https://atta.szlcsc.com/upload/public/pdf/source/20200306/C422600_1E6D84923E4A46A82E41ADD87F860B5C.pdf; Supplier: LCSC; Type: 厚膜电阻; Tolerance: ±1%; Power(Watts): 100mW; Temperature Coefficient: ±100ppm/℃; Overload Voltage (Max): 75V; Operating Temperature Range: -55℃~+155℃
R11 = ERJ3EKF1183V: 电阻类型:厚膜电阻;阻值:118kΩ;精度:±1%;功率:100mW;温度系数:±100ppm/℃;最大工作电压:-;工作温度范围:-55℃~+155℃;; LCSC Part Name: 118kΩ±1%100mW; Supplier Part: C402896; Manufacturer: PANASONIC(松下); Supplier Footprint: 0603; JLCPCB Part Class: ExtendedPart; Datasheet: https://atta.szlcsc.com/upload/public/pdf/source/20190709/C402896_051BAD9E0EE94628DA6EDCE940A23B71.pdf; Supplier: LCSC; Type: 厚膜电阻; Tolerance: ±1%; Power(Watts): 100mW; Temperature Coefficient: ±100ppm/℃; Operating Temperature Range: -55℃~+155℃
R13 = 0603WAF1202T5E: 电阻类型:厚膜电阻;阻值:12kΩ;精度:±1%;功率:100mW;温度系数:±100ppm/℃;最大工作电压:75V;工作温度范围:-55℃~+155℃;; LCSC Part Name: 12kΩ±1%100mW; Supplier Part: C22790; Manufacturer: UNI-ROYAL(厚声); Supplier Footprint: 0603; JLCPCB Part Class: BasicPart; Datasheet: https://atta.szlcsc.com/upload/public/pdf/source/20200306/C422600_1E6D84923E4A46A82E41ADD87F860B5C.pdf; Supplier: LCSC; Type: 厚膜电阻; Tolerance: ±1%; Power(Watts): 100mW; Temperature Coefficient: ±100ppm/℃; Overload Voltage (Max): 75V; Operating Temperature Range: -55℃~+155℃
R15 = RC0603FR-072M32L: 阻值:2.32MΩ;精度:±1%;功率:100mW;温度系数:±100ppm/℃;最大工作电压:75V;工作温度范围:-55℃~+155℃;; LCSC Part Name: 2.32MΩ±1%100mW; Supplier Part: C482791; Manufacturer: YAGEO(国巨); Supplier Footprint: 0603; JLCPCB Part Class: ExtendedPart; Datasheet: https://atta.szlcsc.com/upload/public/pdf/source/20200715/C482791_BF3B93AC40CF51E6746C24A7611E3F1E.pdf; Supplier: LCSC; Tolerance: ±1%; Power(Watts): 100mW; Temperature Coefficient: ±100ppm/℃; Overload Voltage (Max): 75V; Operating Temperature Range: -55℃~+155℃
R16 = 0603WAF5232T5E: 电阻类型:厚膜电阻;阻值:52.3kΩ;精度:±1%;功率:100mW;温度系数:±100ppm/℃;最大工作电压:75V;工作温度范围:-55℃~+155℃;; LCSC Part Name: 52.3kΩ±1%100mW; Supplier Part: C23198; Manufacturer: UNI-ROYAL(厚声); Supplier Footprint: 0603; JLCPCB Part Class: ExtendedPart; Datasheet: https://atta.szlcsc.com/upload/public/pdf/source/20200306/C422600_1E6D84923E4A46A82E41ADD87F860B5C.pdf; Supplier: LCSC; Type: 厚膜电阻; Tolerance: ±1%; Power(Watts): 100mW; Temperature Coefficient: ±100ppm/℃; Overload Voltage (Max): 75V; Operating Temperature Range: -55℃~+155℃
R18 = 0603WAF6190T5E: 电阻类型:厚膜电阻;阻值:619Ω;精度:±1%;功率:100mW;温度系数:±100ppm/℃;最大工作电压:75V;工作温度范围:-55℃~+155℃;; LCSC Part Name: 619Ω±1%100mW; Supplier Part: C23218; Manufacturer: UNI-ROYAL(厚声); Supplier Footprint: 0603; JLCPCB Part Class: ExtendedPart; Datasheet: https://atta.szlcsc.com/upload/public/pdf/source/20200306/C422600_1E6D84923E4A46A82E41ADD87F860B5C.pdf; Supplier: LCSC; Type: 厚膜电阻; Tolerance: ±1%; Power(Watts): 100mW; Temperature Coefficient: ±100ppm/℃; Overload Voltage (Max): 75V; Operating Temperature Range: -55℃~+155℃
R19 = 0603WAF5901T5E: 电阻类型:厚膜电阻;阻值:5.9kΩ;精度:±1%;功率:100mW;温度系数:±100ppm/℃;最大工作电压:75V;工作温度范围:-55℃~+155℃;; LCSC Part Name: 5.9kΩ±1%100mW; Supplier Part: C23071; Manufacturer: UNI-ROYAL(厚声); Supplier Footprint: 0603; JLCPCB Part Class: ExtendedPart; Datasheet: https://atta.szlcsc.com/upload/public/pdf/source/20200306/C422600_1E6D84923E4A46A82E41ADD87F860B5C.pdf; Supplier: LCSC; Type: 厚膜电阻; Tolerance: ±1%; Power(Watts): 100mW; Temperature Coefficient: ±100ppm/℃; Overload Voltage (Max): 75V; Operating Temperature Range: -55℃~+155℃
R21 = 0603WAF3162T5E: 电阻类型:厚膜电阻;阻值:31.6k;精度:±1%;功率:1/10W;温度系数:±100ppm/;最大工作电压:75V;工作温度范围:-55~+155;; LCSC Part Name: 31.6k ±1%; Supplier Part: C25967; Manufacturer: UNI-ROYAL(厚声); Supplier Footprint: 0603; JLCPCB Part Class: ExtendedPart; Datasheet: https://atta.szlcsc.com/upload/public/pdf/source/20200306/C422600_1E6D84923E4A46A82E41ADD87F860B5C.pdf; Supplier: LCSC; Type: 厚膜电阻; Tolerance: ±1%; Power(Watts): 1/10W; Temperature Coefficient: ±100ppm/; Overload Voltage (Max): 75V; Operating Temperature Range: -55~+155
R23 = 0603WAF1002T5E: 电阻类型:厚膜电阻;阻值:10k;精度:±1%;功率:1/10W;温度系数:±100ppm/;最大工作电压:75V;工作温度范围:-55~+155;; LCSC Part Name: 10k ±1%; Supplier Part: C25804; Manufacturer: UNI-ROYAL(厚声); Supplier Footprint: 0603; JLCPCB Part Class: BasicPart; Datasheet: https://atta.szlcsc.com/upload/public/pdf/source/20200306/C422600_1E6D84923E4A46A82E41ADD87F860B5C.pdf; Supplier: LCSC; Type: 厚膜电阻; Tolerance: ±1%; Power(Watts): 1/10W; Temperature Coefficient: ±100ppm/; Overload Voltage (Max): 75V; Operating Temperature Range: -55~+155
R36 = 0603WAF4701T5E: 电阻类型:厚膜电阻;阻值:4.7kΩ;精度:±1%;功率:100mW;温度系数:±100ppm/℃;最大工作电压:75V;工作温度范围:-55℃~+155℃;; LCSC Part Name: 4.7kΩ±1%100mW; Supplier Part: C23162; Manufacturer: UNI-ROYAL(厚声); Supplier Footprint: 0603; JLCPCB Part Class: BasicPart; Datasheet: https://atta.szlcsc.com/upload/public/pdf/source/20200306/C422600_1E6D84923E4A46A82E41ADD87F860B5C.pdf; Supplier: LCSC; Type: 厚膜电阻; Tolerance: ±1%; Power(Watts): 100mW; Temperature Coefficient: ±100ppm/℃; Overload Voltage (Max): 75V; Operating Temperature Range: -55℃~+155℃
U1 U5 = ADP7118AUJZ-R7: 输出类型:-;; Supplier Part: C514355; Manufacturer: ADI(亚德诺)/LINEAR; Supplier Footprint: TSOT-5; JLCPCB Part Class: ExtendedPart; Datasheet: https://atta.szlcsc.com/upload/public/pdf/source/20180628/C194022_239F12D87A493F0A2DF0E3CFBC8CAC3D.pdf; Supplier: LCSC
U2 = ADP5070ACPZ-R7: Supplier Part: C659268; Manufacturer: ADI(亚德诺)/LINEAR(凌特); Supplier Footprint: LFCSP-20; JLCPCB Part Class: ExtendedPart; Datasheet: https://atta.szlcsc.com/upload/public/pdf/source/20201201/C659267_82167F50DBE1C877169DF4968FFAEF20.pdf; Supplier: LCSC
U3 = ADP7182AUJZ-R7: 输出类型:-;; Supplier Part: C514358; Manufacturer: ADI(亚德诺)/LINEAR; Supplier Footprint: TSOT-23-5; JLCPCB Part Class: ExtendedPart; Datasheet: https://atta.szlcsc.com/upload/public/pdf/source/20200415/C514357_C62C5F16D10E6100853AA0BDD3A28C3C.pdf; Supplier: LCSC
U4 = MX128-2.54-06P-GN01-Cu-Y-A: 结构:1x6P;间距:2.54mm;颜色:绿色;安装方式:直插;排数:1;每排PIN数:6;额定电流:6A;额定电压:150V;线规 - AWG:18~24;线规 - 平方毫米:1;工作温度:-40℃~+105℃;; LCSC Part Name: 1x6P 2.54mm 直插 排数:1 每排P数:6; Supplier Part: C5188446; Manufacturer: MAX(迈旭); Supplier Footprint: 插件,P=2.54mm; JLCPCB Part Class: 扩展库; Datasheet: https://atta.szlcsc.com/upload/public/pdf/source/20250320/39CF67EAC718F5AC600D0D1AE915BA0E.pdf; Supplier: LCSC; Number of Positions or Pins: 1x6P; Pitch: 2.54mm; Color: 绿色; Mounting Type: 直插; Number of Pins: 6P; Number of Rows: 1; Number of PINs Per Row: 6; Screw Specification: M1.6; Current Rating: 6A; Voltage Rating (Max): 150V; Wire Gauge - AWG: 18~24; Wire Gauge - mm2: 1; Operating Temperature: -40℃~+105℃
U20 = DB125-2.54-2P-GN-S: 结构:1x2P;间距:2.54mm;颜色:绿色;安装方式:直插;排数:1;每排PIN数:2;额定电流:7A;额定电压:150V;线规 - AWG:18~26;线规 - 平方毫米:1;工作温度:-40℃~+105℃;; LCSC Part Name: 1x2P 2.54mm 直插 排数:1 每排P数:2; Supplier Part: C918120; Manufacturer: DORABO(地博电气); Supplier Footprint: 插件,P=2.54mm; JLCPCB Part Class: 扩展库; Datasheet: https://atta.szlcsc.com/upload/public/pdf/source/20230106/BCD3A0BE1EB95DC3E813F1745F022035.pdf; Supplier: LCSC; Number of Positions or Pins: 1x2P; Pitch: 2.54mm; Color: 绿色; Mounting Type: 直插; Number of Pins: 2P; Number of Rows: 1; Number of PINs Per Row: 2; Current Rating: 7A; Voltage Rating (Max): 150V; Wire Gauge - AWG: 18~26; Wire Gauge - mm2: 1; Operating Temperature: -40℃~+105℃
USBC1 = TYPE-C-31-M-12: 连接器类型:Type-C;标准:-;公母:母座;触点数量:16;端口数量:1;额定电流 - 电源:250mA;; LCSC Part Name: Type-C 母座; Supplier Part: C165948; Manufacturer: 韩国韩荣; Supplier Footprint: SMD; JLCPCB Part Class: Extended Part; Datasheet: https://atta.szlcsc.com/upload/public/pdf/source/20210111/C2682493_D8CCFED08835E878D16ACCF4460E43B8.pdf; Supplier: LCSC; Connector Type: Type-C; Gender: 母座; Number of Contacts: 16; Number of Ports: 1; Current Rating - Power (Max): 250mA

## Nets
3V3: C21.1 C22.1 C25.1 C40.1 C41.1 C53.1 C54.1 CN1.1 R24.1 R25.2 R27.2 R32.1 R34.1 U7.15(DVCC) U8.16(DVDD) U13.15(DVCC) U16.15(DVCC)
+5V: C9.2 H8.2 H12.1 U2.15(PVIN1) U2.16(PVINSYS) U2.17(PVIN2)
+5VLDO: C17.1 C18.2 C27.1 LED2.1(A) R21.2 U4.6 U5.5(VOUT) U8.2(AVDD)
+12V: C4.1 C7.2 C23.2 C24.2 C28.2 C29.2 C30.1 C31.1 C42.2 C43.2 C45.2 C46.2 C47.1 C48.1 C55.2 C56.2 C58.2 C59.2 C60.1 C61.1 LED1.1(A) R3.2 U1.5(VOUT) U4.4 U6.2(VIN) U7.8(VDD) U11.7(V+) U12.2(VIN) U13.8(VDD) U15.7(V+) U16.8(VDD) U17.2(VIN) U19.7(V+)
-12V: C11.2 C15.2 C19.1 C20.1 C36.2 C37.2 C38.1 C39.1 C49.2 C50.2 C51.1 C52.1 C62.2 C63.2 LED3.2(C) R16.2 U3.5(VOUT) U4.5 U7.6(VSS) U11.4(V-) U13.6(VSS) U15.4(V-) U16.6(VSS) U19.4(V-)
AGND: C1.2 C2.1 C4.2 C5.2 C6.1 C8.2 C9.1 C10.2 C11.1 C17.2 C19.2 C20.2 C21.2 C22.2 C23.1 C24.1 C25.2 C26.1 C27.2 C28.1 C29.1 C30.2 C31.2 C32.1 C33.1 C34.1 C35.1 C36.1 C37.1 C38.2 C39.2 C40.2 C41.2 C42.1 C43.1 C44.1 C45.1 C46.1 C47.2 C48.2 C49.1 C50.1 C51.2 C52.2 C53.2 C54.2 C55.1 C56.1 C57.1 C58.1 C59.1 C60.2 C61.2 C62.1 C63.1 C64.2 C65.1 C66.2 CN1.2 CN1.11 D3.2(A) H1.1 H2.1 H3.1 H6.1 H7.1 H10.3 H11.1 L1.1 R1.1 R5.1 R8.1 R9.1 R10.1 R12.2 R19.1 R23.1 R28.2 R29.2 R36.2 RF2.1 RF2.2 RF2.3 RF2.4 RF3.1 RF3.2 RF3.3 RF3.4 RF4.1 RF4.2 RF4.3 RF4.4 RF9.1 RF9.2 RF9.3 RF9.4 U1.2(GND) U2.13(AGND) U2.19(PGND) U2.21(EP) U3.1(GND) U4.1 U5.2(GND) U6.4(GND) U7.5(AGND) U7.16(DGND) U8.1(DGND) U8.3(AGND) U8.5(REFGND) U8.8(AIN_GND) U12.4(GND) U13.5(AGND) U13.16(DGND) U16.5(AGND) U16.16(DGND) U17.4(GND) U20.1 USBC1.0 USBC1.A1(GND) USBC1.A12(GND) USBC1.B1(GND) USBC1.B12(GND)
ADCIN: R31.2 RF9.5 U9.1
CS1: CN1.5 U8.11(CONVST/CS#)
DAC_OUT1: R30.2 U11.2(-IN) U11.6(OUT)
DAC_OUT2: R33.2 U15.2(-IN) U15.6(OUT)
DAC_OUT3: R35.2 U19.2(-IN) U19.6(OUT)
EN1: H1.2 U2.7(EN1)
EN2: H2.2 U2.9(EN2)
SCLK1: CN1.7 U8.12(SCLK)
SCLK2: CN1.6 U7.14(SCLK) U13.14(SCLK) U16.14(SCLK)
SDI1: CN1.3 U8.10(SDI)
SDI2: CN1.4 U7.12(SDI) U13.12(SDI) U16.12(SDI)
SDO1: CN1.9 R25.1 U8.13(SDO-0)
SEQ: H3.2 U2.3(SEQ)
SLEW: H6.2 U2.4(SLEW)
SS: H4.2 U2.8(SS)
SYNC: H7.2 U2.2(SYNC/FREQ)
SYNC1: CN1.8 U7.13(SYNC#)
SYNC2: CN1.10 U13.13(SYNC#)
SYNC3: CN1.12 U16.13(SYNC#)
USB_VCC: H12.2 U20.2 USBC1.A4(VBUS) USBC1.A9(VBUS) USBC1.B4(VBUS) USBC1.B9(VBUS)
V_EN: D3.1(C) H1.3 H2.3 R7.1 R9.2
VNEG: C2.2 C6.2 D2.2(A) H9.1 R15.2 U4.2
VPOS: C1.1 C5.1 D1.1(C) H5.2 H13.2 R6.1 U4.3
VREF1: C26.2 U6.6(VOUT) U7.4(VREFIN/VREFOUT)
VREF2: C44.2 U12.6(VOUT) U13.4(VREFIN/VREFOUT)
VREF3: C57.2 U16.4(VREFIN/VREFOUT) U17.6(VOUT)
VREG: C8.1 H3.3 H6.3 H7.3 U2.14(VREG)
$1N2268: L2.1 U2.1(INBK)
$1N2301: D1.2(A) L2.2 U2.20(SW1)
$1N2768: D2.1(C) L1.2 U2.18(SW2)
$1N4863: C10.1 R11.2 U2.12(VREF)
$1N5027: H10.1 R6.2 R8.2 U2.5(FB1)
$1N5900: H11.3 R11.1 R15.1 U2.11(FB2)
$1N6634: R13.2 U2.6(COMP1)
$1N6660: R14.2 U2.10(COMP2)
$1N6686: C13.2 R13.1
$1N6748: C14.2 R14.1
$1N7096: C13.1 H10.2
$1N7120: C14.1 H11.2
$1N10840: H8.1 R7.2
$1N12151: H4.1 R1.2
$1N13840: R2.2 U1.3(EN)
$1N15786: R3.1 R4.1 R5.2 U1.4(SENSE/ADJ)
$1N16226: C7.1 R4.2
$1N17984: C66.1 H5.1 R2.1 U1.1(VIN)
$1N19681: C65.2 H9.2 R17.1 U3.2(VIN)
$1N20044: R17.2 U3.3(EN)
$1N21295: R16.1 R18.1 R19.2 U3.4(NC/ADJ)
$1N21739: C15.1 R18.2
$1N22287: C18.1 R22.2
$1N22288: R21.1 R22.1 R23.2 U5.4(SENSE/ADJ)
$1N22290: R20.2 U5.3(EN)
$1N22291: C64.1 H13.1 R20.1 U5.1(VIN)
$1N42520: R10.2 USBC1.B5(CC2)
$1N42526: R12.1 USBC1.A5(CC1)
$1N44676: LED2.2(C) R36.1
$1N44679: LED3.1(A) R29.1
$1N44681: LED1.2(C) R28.1
$2N3215: C35.2 R31.1 U8.7(AIN_P)
$2N3217: C33.2 C34.2 U8.6(REFCAP)
$2N3218: R26.2 U8.4(REFIO)
$2N3219: C32.2 R26.1
$2N3238: R27.1 U8.9(RST#)
$2N4733: U7.7(VOUT) U11.3(+IN)
$2N4737: LED4.2(C) U7.1(ALERT#)
$2N4738: LED4.1(A) R24.2
$2N4761: R30.1 RF2.5 U10.1
$2N6887: R33.1 RF3.5 U14.1
$2N6893: U13.7(VOUT) U15.3(+IN)
$2N6907: LED5.2(C) U13.1(ALERT#)
$2N6908: LED5.1(A) R32.2
$2N7919: R35.1 RF4.5 U18.1
$2N7925: U16.7(VOUT) U19.3(+IN)
$2N7939: LED6.2(C) U16.1(ALERT#)
$2N7940: LED6.1(A) R34.2

Not connected (* = marked no-connect by the designer): U6 1(TP)* 3(NIC)* 5(TRIM)* 7(NIC)* 8(TP)*; U7 2(CLEAR#)* 3(RESET#)* 9(DNC)* 10(SDO)* 11(LDAC#)*; U8 14(ALARM/SDO-1/GPO)* 15(RVS)*; U11 1(NC)* 5(NC)* 8(NC)*; U12 1(TP)* 3(NIC)* 5(TRIM)* 7(NIC)* 8(TP)*; U13 2(CLEAR#)* 3(RESET#)* 9(DNC)* 10(SDO)* 11(LDAC#)*; U15 1(NC)* 5(NC)* 8(NC)*; U16 2(CLEAR#)* 3(RESET#)* 9(DNC)* 10(SDO)* 11(LDAC#)*; U17 1(TP)* 3(NIC)* 5(TRIM)* 7(NIC)* 8(TP)*; U19 1(NC)* 5(NC)* 8(NC)*; USBC1 A6(DP1)* A7(DN1)* A8(SBU1)* B6(DP2)* B7(DN2)* B8(SBU2)*

## Notes on the sheets
sheet 1
- +12V LDO
- DC-DC Converter
- Connector
- -12V LDO
- Voltage Series IN/OUT
- Power Status Indicate
- +5V LDO
sheet 2
- ADC
- DAC1
- Connector
- Net Flag
- DAC2
- DAC3
